# EAGLE design RS232_NPN_PNP_FTDI232 (EAGLE 7.6.0)
RS232 Adapter using NPN and PNP Transistors
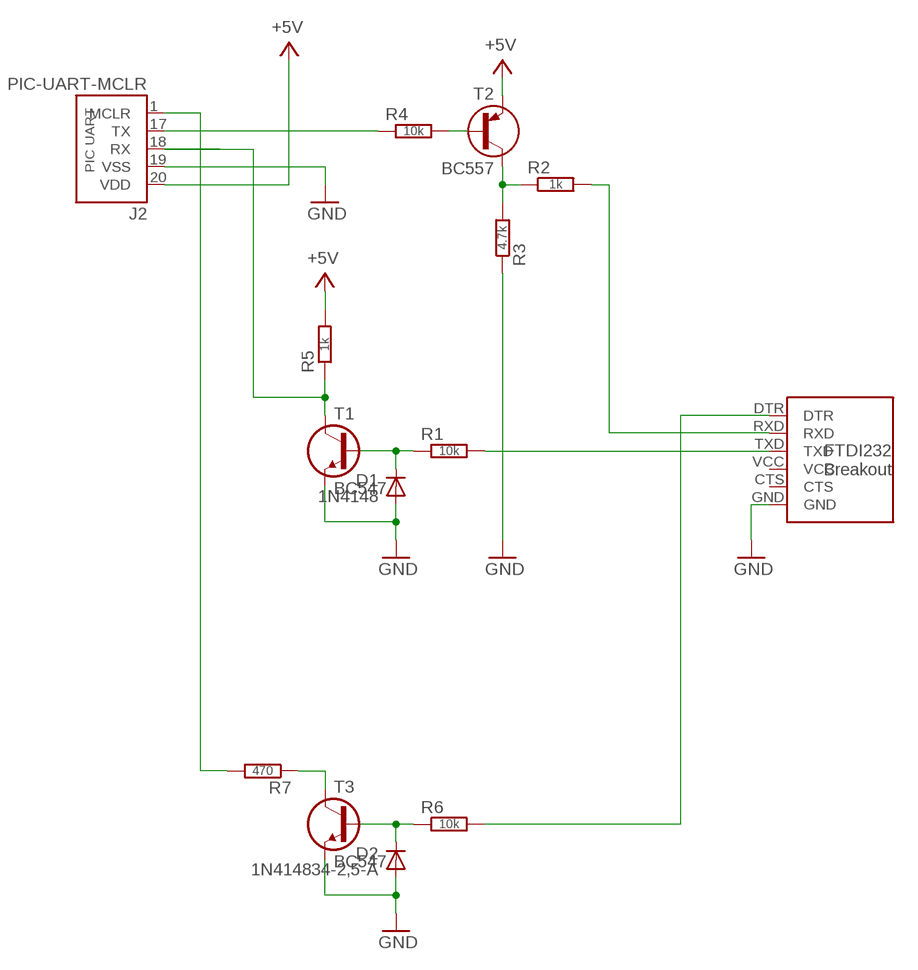
[diagram p0: schematic, sheet 1]

## Parts
D1  1N4148  1N414834-5  [DO34-5]
D2  1N414834-2,5-A  [DO34-2,5-A]
J1  FTDI232-BO-R  [FTDI232-BO-L]
J2  PIC-UART-MCLR  [PIC-UART-MCLR]
R1  10k  R0202/5  [0202/5]
R2  1k  R0202/10  [0202/10]
R3  4.7k  R0202/5  [0202/5]
R4  10k  R0202/7-V  [0202/7-V]
R5  1k  R0202/5-V  [0202/5-V]
R6  10k  R0202/7-V  [0202/7-V]
R7  470  R0202/7-V  [0202/7-V]
T1  BC547  BC547CBE  [TO92-CBE]
T2  BC557  BC557CBE  [TO92-CBE]
T3  BC547  BC547CBE  [TO92-CBE]

## Nets
+5V: J2.20(VDD) R5.2 T2.E
GND: D1.A D2.A J1.GND J2.19(VSS) R3.1 T1.E T3.E
N$1: J2.18(RX) R5.1 T1.C
N$2: D1.C R1.1 T1.B
N$3: J1.TXD R1.2
N$4: J2.17(TX) R4.1
N$5: R4.2 T2.B
N$6: R2.1 R3.2 T2.C
N$7: J1.RXD R2.2
N$8: J2.1(MCLR) R7.2
N$9: D2.C R6.1 T3.B
N$10: J1.DTR R6.2
N$11: R7.1 T3.C
Unconnected: J1.CTS J1.VCC

## Library data of the parts
D1 D2 = d:1N4148
J1 = pinconn:FTDI232-BO
J2 = pinconn:PIC-UART-MCLR
R1-R7 = r:R: RESISTOR, European symbol
T1 T3 = t:BC547
T2 = t:BC557

## Board
RS232 Adapter using NPN and PNP Transistors
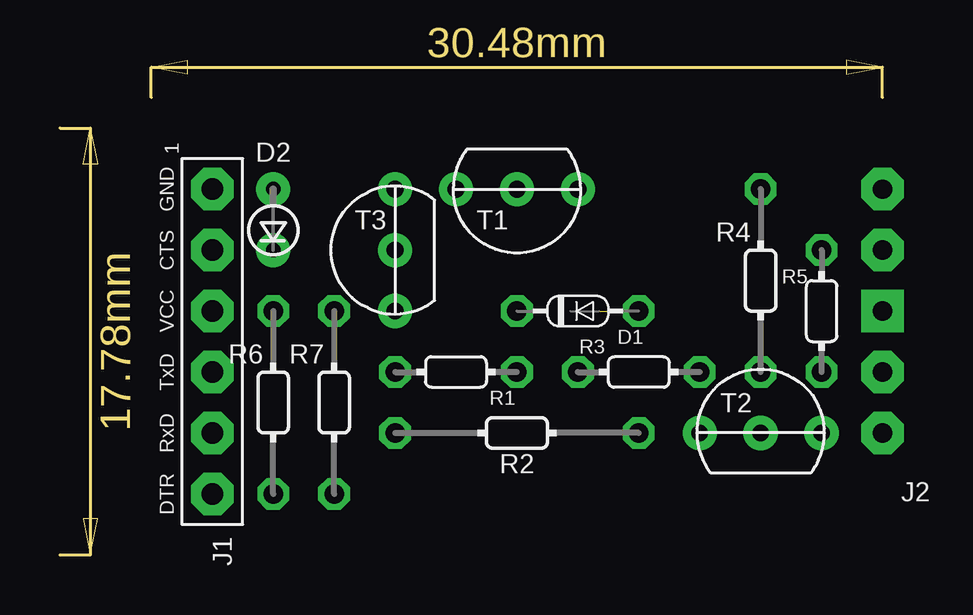
[diagram p1: board, top side]
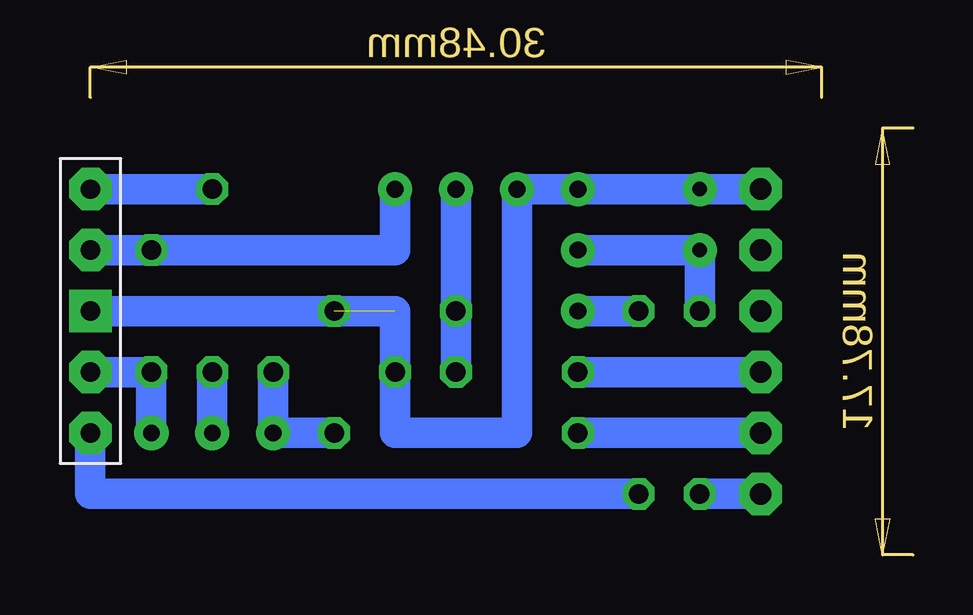
[diagram p2: board, bottom side, seen from below]

Size 34.29 x 20.62 mm. Coordinates in mm from the lower left corner, seen from the top.
Copper layers (1*16): Top 0.035mm / dielectric 1.5mm / Bottom 0.035mm
Design rules "default": minimum track width 10mil, minimum drill 24mil, track to track 8mil, track to pad 8mil, pad to pad 8mil, via to via 8mil, smd to smd 8mil, copper to edge 40mil, drill to drill 8mil, minimum pad ring 10mil, minimum via ring 8mil, stop-mask expansion 4mil, vias tented up to drill 0mil, thermal gap 10mil

### Footprints (pad centres in the part's own frame; a part is rotated, then mirrored left to right if it is on the bottom)
DO34-5 = drill 0.813 octagon: A 2.54,0; C -2.54,0
DO34-2,5-A = drill 0.6 pad 1.422: A 1.27,0; C -1.27,0
FTDI232-BO-L = drill 0.9 pad 1.778 octagon: CTS 0,3.81; DTR 0,-6.35; GND 0,6.35; RXD 0,-3.81; TXD 0,-1.27; VCC 0,1.27
PIC-UART-MCLR = drill 0.8 pad 1.778 octagon: 1 5.08,0; 17 -5.08,0; 18 -2.54,0; 20 2.54,0 | drill 0.8 pad 1.778 square: 19 0,0
0202/5 = drill 0.813 octagon: 1 -2.54,0; 2 2.54,0
0202/10 = drill 0.813 octagon: 1 -5.08,0; 2 5.08,0
0202/7-V = drill 0.813 octagon: 1 0,-3.81; 2 0,3.81
0202/5-V = drill 0.813 octagon: 1 0,2.54; 2 0,-2.54
TO92-CBE = drill 0.7 pad 1.422: B 0,0; C 0,2.54; E 0,-2.54

### Placement (x,y rotation side)
D1  21.59,10.16 0 top
D2  8.89,13.97 90 top
J1  6.35,8.89 0 top
J2  34.29,10.16 270 top
R1  10kΩ  [0202/5]  16.51,7.62 180 top
R2  1kΩ  [0202/10]  19.05,5.08 180 top
R3  4.7kΩ  [0202/5]  24.13,7.62 0 top
R4  10kΩ  [0202/7-V]  29.21,11.43 180 top
R5  1kΩ  [0202/5-V]  31.75,10.16 0 top
R6  10kΩ  [0202/7-V]  8.89,6.35 180 top
R7  470Ω  [0202/7-V]  11.43,6.35 180 top
T1  19.05,15.24 270 top
T2  29.21,5.08 90 top
T3  13.97,12.7 180 top

### Tracks (layer width: path | path; a pad name or v marks a point on that pad's centre or on a via)
+5V
  Bottom 1.27: T2.E R5.2 J2.20
GND  (1 unrouted)
  Bottom 1.27: J2.19 21.59,10.16 R3.1 21.59,5.08 16.51,5.08 T1.E | T1.E D2.A J1.GND | T1.E T3.E
N$1
  Bottom 1.27: T1.C 21.59,12.7 R5.1 J2.18
N$2
  Bottom 1.27: T1.B D1.C R1.1
N$3
  Bottom 1.27: R1.2 J1.TXD
N$4
  Bottom 1.27: J2.17 R4.1
N$5
  Bottom 1.27: T2.B R4.2
N$6
  Bottom 1.27: R2.1 T2.C R3.2
N$7
  Bottom 1.27: R2.2 J1.RXD
N$8
  Bottom 1.27: J2.1 34.29,2.54 R7.2
N$9
  Bottom 1.27: R6.1 D2.C T3.B
N$10
  Bottom 1.27: J1.DTR R6.2
N$11
  Bottom 1.27: R7.1 T3.C